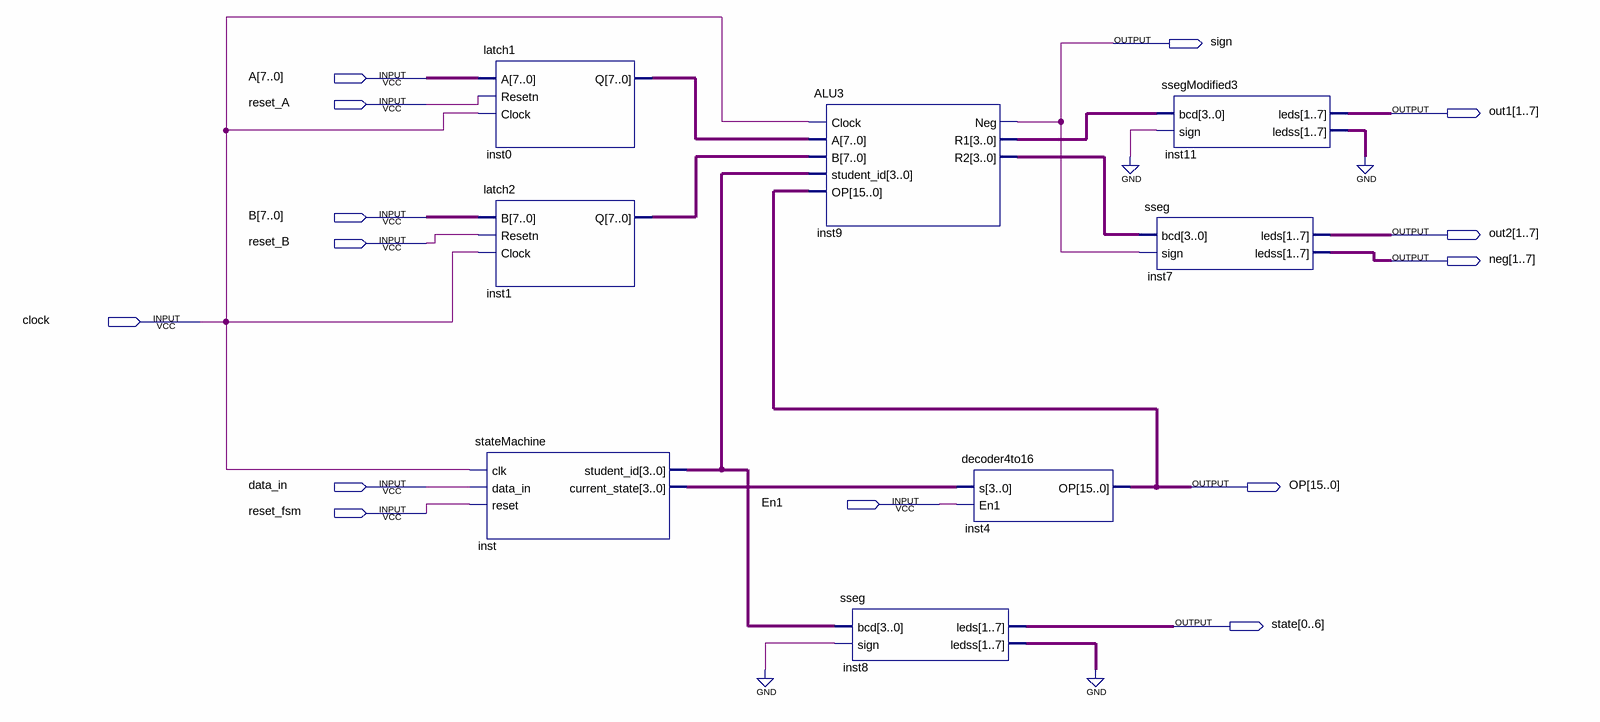
[diagram p0: schematic sheet]
// Quartus schematic lab6_diagram3.bdf as structural Verilog: 8 symbols, 14 pins
module lab6_diagram3 (
  input  [7:0] A,
  input  reset_A,
  input  [7:0] B,
  input  reset_B,
  input  clock,
  input  data_in,
  input  En1,
  input  reset_fsm,
  output sign,
  output [1:7] out1,
  output [1:7] out2,
  output [1:7] neg,
  output [15:0] OP,
  output [0:6] state
);

  wire [3:0] inst9_r1, inst9_r2, inst_current_state, inst_student_id;
  wire [6:0] inst8_ledss, inst11_ledss;
  wire [7:0] inst0_q, inst1_q;

  latch1 inst0 (.A(A), .Resetn(reset_A), .Clock(clock), .Q(inst0_q));
  latch2 inst1 (.B(B), .Resetn(reset_B), .Clock(clock), .Q(inst1_q));
  stateMachine inst (
    .clk(clock), .data_in(data_in), .reset(reset_fsm), .student_id(inst_student_id),
    .current_state(inst_current_state));
  ALU3 inst9 (
    .Clock(clock), .A(inst0_q), .B(inst1_q), .student_id(inst_student_id), .OP(OP), .Neg(sign),
    .R1(inst9_r1), .R2(inst9_r2));
  sseg inst8 (.bcd(inst_student_id), .sign(1'b0), .leds(state), .ledss(inst8_ledss));
  decoder4to16 inst4 (.s(inst_current_state), .En1(En1), .OP(OP));
  ssegModified3 inst11 (.bcd(inst9_r1), .sign(1'b0), .leds(out1), .ledss(inst11_ledss));
  sseg inst7 (.bcd(inst9_r2), .sign(sign), .leds(out2), .ledss(neg));
  // also tied to GND on the sheet: {inst8_ledss[0], inst8_ledss[1], inst8_ledss[2], inst8_ledss[3], inst8_ledss[4], inst8_ledss[5], inst8_ledss[6], inst11_ledss[0], inst11_ledss[1], inst11_ledss[2], inst11_ledss[3], inst11_ledss[4], inst11_ledss[5], inst11_ledss[6]}
endmodule
